# EAGLE schematic E565AFEE (EAGLE 6.1)
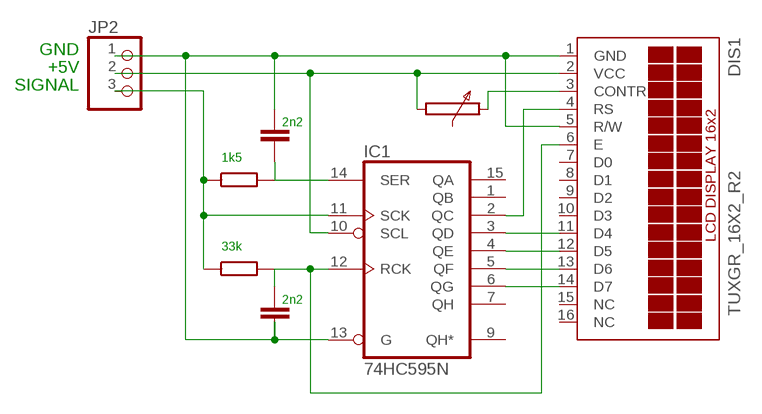
[diagram p0: schematic, sheet 1]

## Parts
DIS1  TUXGR_16X2_R2  [TUXGR_16X2_R2]
IC1  74HC595N  [DIL16]
JP2  PINHD-1X3  [1X03]

## Nets
N$1: DIS1.1(GND) DIS1.5(R/W) IC1.13(G) JP2.1
N$2: DIS1.2(VCC) IC1.10(SCL) JP2.2
N$3: DIS1.3(CONTR)
N$4: DIS1.4(RS) IC1.2(QC)
N$6: DIS1.11(D4) IC1.3(QD)
N$7: DIS1.12(D5) IC1.4(QE)
N$8: DIS1.13(D6) IC1.5(QF)
N$9: DIS1.14(D7) IC1.6(QG)
N$10: IC1.11(SCK) JP2.3
N$12: IC1.14(SER)
N$13: DIS1.6(E) IC1.12(RCK)
Unconnected: DIS1.7(D0) DIS1.8(D1) DIS1.9(D2) DIS1.10(D3) DIS1.15(NC) DIS1.16(NC) IC1.1(QB) IC1.7(QH) IC1.9(QH*) IC1.15(QA)

## Notes on the sheet
- GND
- +5V
- SIGNAL
- 2n2
- 1k5
- 33k
- 2n2

## Power pins joined to a net without a drawn wire
GND: IC1.8(GND)
VCC: IC1.16(VCC)

## Library data of the parts
DIS1 = display-lcd:TUXGR_16X2_R2: Tuxgraphics LCD display 16x2 characters reflective, without background light Source: tuxgr_12x2_r2.pdf; OC_FARNELL: unknown; OC_NEWARK: unknown
IC1 = 74xx-eu:74*595: 8-bit SHIFT REGISTER, output latch
JP2 = pinhead:PINHD-1X3: PIN HEADER